# Altium project Rev1.PrjPcb
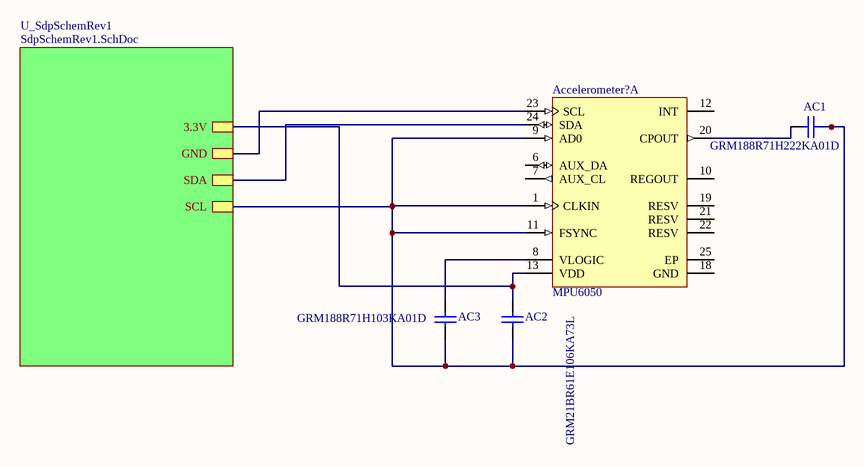
[diagram p0: Accelerometer.SchDoc]
5 sheets, 106 parts. Net scope: hierarchical (ports join the sheet entries above them; power ports are global).
Board files: Rev3.PcbDoc, Rev1.PcbDoc
Sheets:
  Accelerometer.SchDoc
    U_SdpSchemRev1 = SdpSchemRev1.SchDoc
  BLE.SchDoc
    U_SdpSchemRev1 = SdpSchemRev1.SchDoc
  SWD.SchDoc
    U_SdpSchemRev1 = SdpSchemRev1.SchDoc
  ChargingController.SchDoc
    U_SdpSchemRev1 = SdpSchemRev1.SchDoc

## Sheet Accelerometer.SchDoc
size A

### Parts
AC1  GRM188R71H222KA01D  [CAPC1608X90X35NL10T15]
AC2  GRM21BR61E106KA73L  [CAPC2013X135X45ML10T25]
AC3  GRM188R71H103KA01D  [CAPC1608X90X35ML10T15]
Accelerometer?  MPU6050  [INSE-QFN-24_V]  (part A of 2)

### Sub-sheets
U_SdpSchemRev1 = SdpSchemRev1.SchDoc: 3.3V, GND, SDA, SCL

### Nets
Net3.3V_Converter_3: AC2.2 Accelerometer?.13(VDD) ; sheet U_SdpSchemRev1/3.3V
Net3.3V_Converter_4: Accelerometer?.23(SCL) ; sheet U_SdpSchemRev1/GND
NetAC1_1: AC1.1 Accelerometer?.20(CPOUT)
NetAC1_2: AC1.2 AC2.1 AC3.1 Accelerometer?.1(CLKIN) Accelerometer?.9(AD0) Accelerometer?.11(FSYNC) ; sheet U_SdpSchemRev1/SCL
NetAC3_2: AC3.2 Accelerometer?.8(VLOGIC)
NetAccelerometer?_24: Accelerometer?.24(SDA) ; sheet U_SdpSchemRev1/SDA

Not connected (* = marked no-connect by the designer): Accelerometer? 6(AUX_DA) 7(AUX_CL) 10(REGOUT) 12(INT) 18(GND) 19(RESV) 21(RESV) 22(RESV) 25(EP)

### Library data of the parts
AC1 = CMP-1662-00006-4: Chip Capacitor, 2.2 nF, +/- 10%, 50 V, -55 to 125 degC, 0603 (1608 Metric), RoHS, Tape and Reel; Manufacturer: Murata; Voltage Rating: 50 V; Pins: 2; Mount: Surface Mount; Max Operating Temperature: 125 degC; ComponentLink1Description: Manufacturer URL; RoHSCompliant: true; PackageDescription: 2-Pin Surface Mount Device, Body 1.6 x 0.8 mm; ComponentLink2URL: http://search.murata.co.jp/Ceramy/image/img/A01X/G101/ENG/GRM188R71H222KA01-01.pdf; PackageReference: 0603; Height: 0.8 mm; Lead Pitch: 4 mm; Packaging: Tape and Reel; DatasheetVersion: 02/2016; Mounting Technology: Surface Mount; ComponentLink2Description: Datasheet; Min Operating Temperature: -55 degC; Length: 1.6 mm; REACH SVHC: No SVHC; Package Quantity: 4000; ComponentLink1URL: http://www.murata.com/
AC2 = CMP-2007-03541-1: Manufacturer: Murata; Part Number: GRM21BR61E106KA73L
AC3 = CMP-2100-03642-1: Chip Capacitor, 10 nF, +/- 10%, 50 V, -55 to 125 degC, 0603 (1608 Metric), RoHS, Tape and Reel; Manufacturer: Murata; Insulation Resistance: 10GR; Dielectric: X7R; Voltage Rating: 50V; Capacitance: 10nF; Dielectric Material: Ceramic; Package Quantity: 1; Lead Free: LeadFree; Case/Package: 0603; Termination: SMD/SMT; REACH SVHC: Unknown; Manufacturer URL: http://www.murata.com/; Datasheet URL: http://search.murata.co.jp/Ceramy/image/img/A01X/G101/ENG/GRM188R71H103KA01-01.pdf; Mount: SurfaceMount; Datasheet Version: 42401.0; Number of Pins: 2; Length: 1.6mm; Voltage: 50V; Depth: 0.8mm; Tolerance: 10%; Min Operating Temperature: -55degC; Voltage Rating (DC): 50V; Max Operating Temperature: 125degC; Package Description: 2-Pin Surface Mount Device, Body 1.6 x 0.8 mm; RoHSCompliant: True; Case Code (Imperial): 0603; Width: 0.031inch; Case Code (Metric): 1608; Height: 0.8mm; Package Reference: 0603; Packaging: TapeandReel; Thickness: 0.035inch; Material: Ceramic
Accelerometer? = CMP-1753-00002-1: 3-Axis Gyroscope, 3-Axis Accelerometer / , 2.375 to 3.46 V, -40 to 105 degC, 24-Pin QFN, RoHS, Tape and Reel; Resistance: 5.6 kohm; Tolerance: 1%; Voltage Rating: 75 V; Power Rating: 100 mW; ComponentLink1Description: Manufacturer URL; Mount: Surface Mount; Max Operating Temperature: 155degC; Package Quantity: 5000; ComponentLink2Description: Datasheet; Pins: 2; Packaging: Tape and Reel; Case Code (Imperial): 0603; PackageReference: QFN-24; ComponentLink2URL: https://datasheet.ciiva.com/1513/1788002-1513632.pdf; Radiation Hardening: No; ComponentLink1URL: http://www.invensense.com/; PackageDescription: 24-Pin Quad Flat No-lead Package, Body 4 x 4 mm, Pitch 0.5 mm; Height: 0.45 mm; Case/Package: 0603; Case Code (Metric): 1608; REACH SVHC: Yes; Min Operating Temperature: -55degC; DatasheetVersion: Rev. 3.4, 08/2013; Width: 0.8 mm; RoHSCompliant: True; Length: 1.6 mm

## Sheet SdpSchemRev1.SchDoc
size A
Used 4 times, as channels U_SdpSchemRev1, U_SdpSchemRev1, U_SdpSchemRev1, U_SdpSchemRev1. Parts and nets are listed once, with the designators drawn on the sheet.
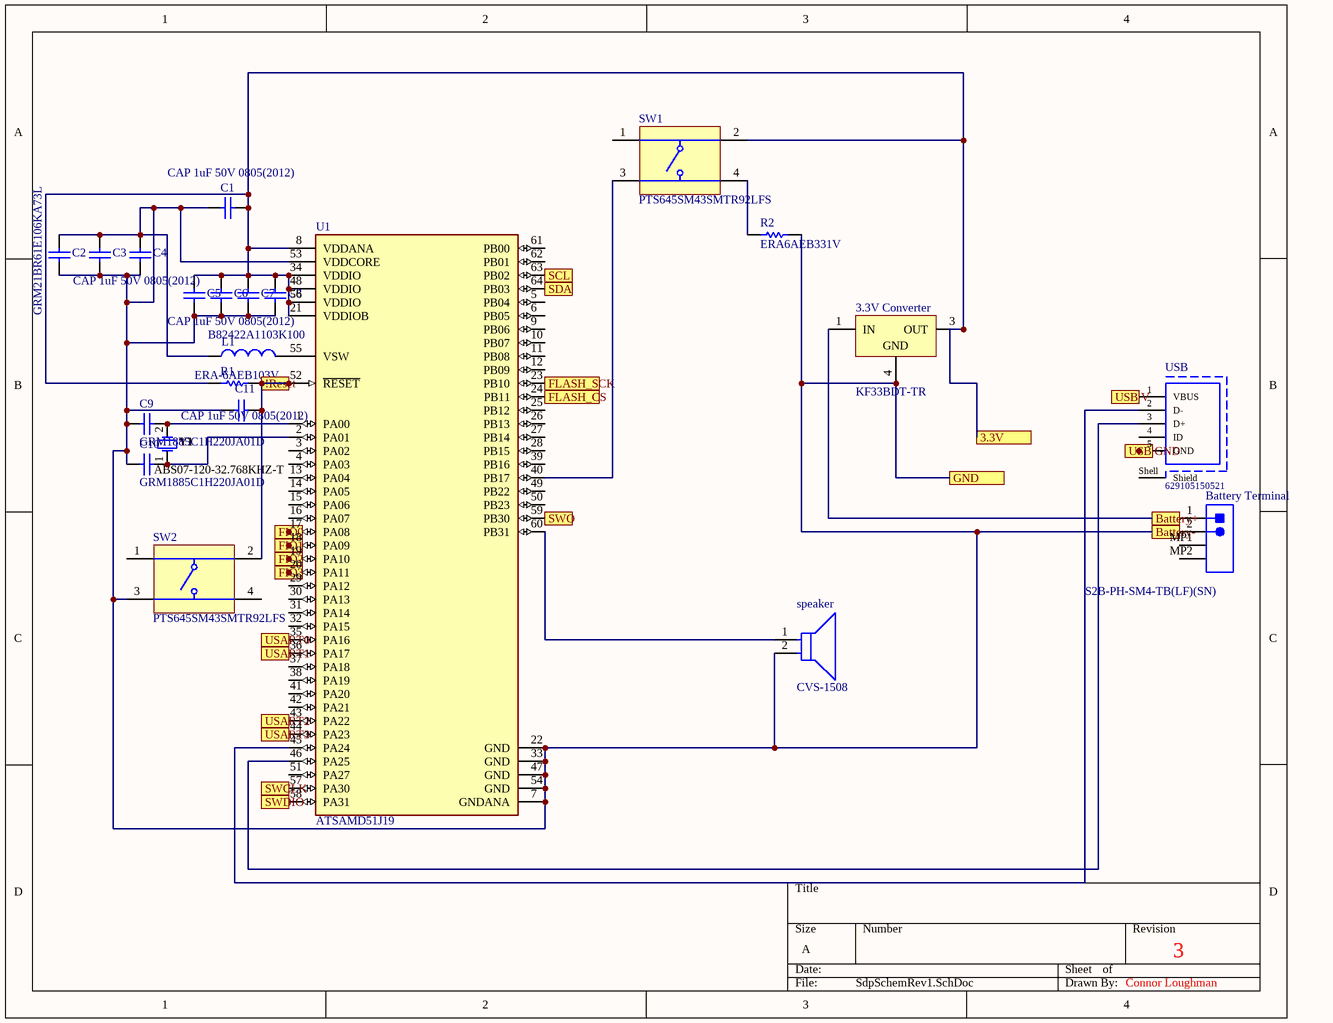
[diagram p1: SdpSchemRev1.SchDoc]

### Parts
3.3V_Converter  KF33BDT-TR  [TO-252_L]
Battery_Terminal  S2B-PH-SM4-TB(LF)(SN)  [JST- S2B-PH-SM4-TB(LF)(SN)-2_V]
C1  CAP 1uF 50V 0805(2012)  [CAPC0805(2012)145_L]
C2  GRM21BR61E106KA73L  [CAPC2013X135X45ML10T25]
C3  (no value)  [CAPC0805(2012)145_L]
C4  CAP 1uF 50V 0805(2012)  [CAPC0805(2012)145_L]
C5  (no value)  [CAPC0805(2012)145_L]
C6  (no value)  [CAPC0805(2012)145_L]
C7  (no value)  [CAPC0805(2012)145_L]
C8  CAP 1uF 50V 0805(2012)  [CAPC0805(2012)145_L]
C9  GRM1885C1H220JA01D  [CAPC1608X90X35ML10T15]
C10  GRM1885C1H220JA01D  [CAPC1608X90X35ML10T15]
C11  CAP 1uF 50V 0805(2012)  [CAPC0805(2012)145_L]
L1  B82422A1103K100  [TDK-B82422A1103K100_V]
R1  ERA-6AEB103V  [RESC2013X60X40LL20T25_A]
R2  ERA6AEB331V  [RESC2013X60X40LL20T25]
speaker  CVS-1508  [FP-CVS-1508-MFG]
SW1  PTS645SM43SMTR92LFS  [ITT-PTS645S-4_V]
SW2  PTS645SM43SMTR92LFS  [ITT-PTS645S-4_V]
U1  ATSAMD51J19  [FP-C04-085-MFG]
USB  629105150521  [629105150521]
Y1  ABS07-120-32.768KHZ-T  [ABRA-ABS07_A_V]

### Ports
3.3V, !Reset, Battery+, Battery-, FIO0, FIO1, FIO2, FIO3, FLASH_CS, FLASH_SCK, GND, SCL, SDA, SWCLK, SWDIO, SWO, USART0, USART1, USART2, USART3, USB GND, USB V

### Nets
3.3V: 3.3V_Converter.3(OUT) C1.2 C5.2 C6.2 C7.2 C8.2 R1.1 SW1.2 U1.8(VDDANA) U1.21(VDDIOB) U1.34(VDDIO) U1.48(VDDIO) U1.56(VDDIO) ; port 3.3V
!Reset: C11.2 R1.2 SW2.2 U1.52(~{RESET}) ; port !Reset
Battery+: 3.3V_Converter.1(IN) Battery_Terminal.1 ; port Battery+
Battery-: 3.3V_Converter.4(GND) Battery_Terminal.2 C1.1 C2.1 C2.2 C3.1 C3.2 C4.1 C4.2 C5.1 C6.1 C7.1 C8.1 C9.1 C10.1 C11.1 L1.1 R2.2 speaker.2(A) SW2.3 U1.7(GNDANA) U1.22(GND) U1.33(GND) U1.47(GND) U1.53(VDDCORE) U1.54(GND) ; port GND, port Battery-
FLASH_CS: U1.24(PB11) ; port FLASH_CS
FLASH_SCK: U1.23(PB10) ; port FLASH_SCK
SCL: U1.63(PB02) ; port SCL
SDA: U1.64(PB03) ; port SDA
SWCLK: U1.57(PA30) ; port SWCLK
SWDIO: U1.58(PA31) ; port SWDIO
SWO: U1.59(PB30) ; port SWO
USART0: U1.35(PA16) ; port USART0
USART1: U1.36(PA17) ; port USART1
USART2: U1.43(PA22) ; port USART2
USART3: U1.44(PA23) ; port USART3
USB V: USB.1(VBUS) ; port USB V
NetC9_2: C9.2 U1.1(PA00) Y1.2
NetC10_2: C10.2 U1.2(PA01) Y1.1
NetL1_2: L1.2 U1.55(VSW)
NetR2_1: R2.1 SW1.4
Netspeaker_1: speaker.1(C) U1.60(PB31)
NetSW1_3: SW1.3 U1.40(PB17)
NetU1_45: U1.45(PA24) USB.2(D-)
NetU1_46: U1.46(PA25) USB.3(D+)

Not connected (* = marked no-connect by the designer): Battery_Terminal MP1 MP2; SW1 1; SW2 1 4; U1 3(PA02) 4(PA03) 5(PB04) 6(PB05) 9(PB06) 10(PB07) 11(PB08) 12(PB09) 13(PA04) 14(PA05) 15(PA06) 16(PA07) 17(PA08) 18(PA09) 19(PA10) 20(PA11) 25(PB12) 26(PB13) 27(PB14) 28(PB15) 29(PA12) 30(PA13) 31(PA14) 32(PA15) 37(PA18) 38(PA19) 39(PB16) 41(PA20) 42(PA21) 49(PB22) 50(PB23) 51(PA27) 61(PB00) 62(PB01); USB 4(ID) 5(GND) Shell(Shield)

### Channels
U_SdpSchemRev1: designators 3.3V Converter=3.3V_Converter Battery Terminal=Battery_Terminal C1=C1 C2=C2 C3=C3 C4=C4 C5=C5 C6=C6 C7=C7 C8=C8 C9=C9 C10=C10 C11=C11 L1=L1 R1=R1 R2=R2 speaker=speaker_U_SdpSchemRev1#1 SW1=SW1 SW2=SW2 U1=U1 USB=USB Y1=Y1; ports 3.3V=Net3.3V_Converter_3 !Reset=NetC11_2 Battery+=Net3.3V_Converter_1 Battery-=Net3.3V_Converter_4 FIO0=open FIO1=open FIO2=open FIO3=open FLASH_CS=NetU1_24 FLASH_SCK=NetU1_23 GND=Net3.3V_Converter_4 SCL=NetAC1_2 SDA=NetAccelerometer?_24 SWCLK=NetU1_57 SWDIO=NetU1_58 SWO=NetU1_59 USART0=NetU1_35 USART1=NetU1_36 USART2=NetU1_43 USART3=NetU1_44 USB GND=open USB V=NetUSB_1
U_SdpSchemRev1: designators 3.3V Converter=3.3V_Converter_U_SdpSchemRev1#1 Battery Terminal=Battery_Terminal_U_SdpSchemRev1#1 C1=C1_U_SdpSchemRev1#1 C2=C2_U_SdpSchemRev1#1 C3=C3_U_SdpSchemRev1#1 C4=C4_U_SdpSchemRev1#1 C5=C5_U_SdpSchemRev1#1 C6=C6_U_SdpSchemRev1#1 C7=C7_U_SdpSchemRev1#1 C8=C8_U_SdpSchemRev1#1 C9=C9_U_SdpSchemRev1#1 C10=C10_U_SdpSchemRev1#1 C11=C11_U_SdpSchemRev1#1 L1=L1_U_SdpSchemRev1#1 R1=R1_U_SdpSchemRev1#1 R2=R2_U_SdpSchemRev1#1 speaker=speaker_U_SdpSchemRev1#2 SW1=SW1_U_SdpSchemRev1#1 SW2=SW2_U_SdpSchemRev1#1 U1=U1_U_SdpSchemRev1#1 USB=USB_U_SdpSchemRev1#1 Y1=Y1_U_SdpSchemRev1#1; ports 3.3V=Net3.3V_Converter_U_SdpSchemRev1#1_3 !Reset=NetC11_U_SdpSchemRev1#1_2 Battery+=Net3.3V_Converter_U_SdpSchemRev1#1_1 Battery-=Net3.3V_Converter_U_SdpSchemRev1#1_4 FIO0=NetQSPI_Flash_5 FIO1=NetQSPI_Flash_2 FIO2=NetQSPI_Flash_3 FIO3=NetQSPI_Flash_7 FLASH_CS=NetQSPI_Flash_1 FLASH_SCK=NetQSPI_Flash_6 GND=Net3.3V_Converter_U_SdpSchemRev1#1_4 SCL=NetU1_U_SdpSchemRev1#1_63 SDA=NetU1_U_SdpSchemRev1#1_64 SWCLK=NetU1_U_SdpSchemRev1#1_57 SWDIO=NetU1_U_SdpSchemRev1#1_58 SWO=NetU1_U_SdpSchemRev1#1_59 USART0=NetU_1 USART1=NetU_2 USART2=NetU_3 USART3=NetU_4 USB GND=open USB V=NetUSB_U_SdpSchemRev1#1_1
U_SdpSchemRev1: designators 3.3V Converter=3.3V_Converter_U_SdpSchemRev1#2 Battery Terminal=Battery_Terminal_U_SdpSchemRev1#2 C1=C1_U_SdpSchemRev1#2 C2=C2_U_SdpSchemRev1#2 C3=C3_U_SdpSchemRev1#2 C4=C4_U_SdpSchemRev1#2 C5=C5_U_SdpSchemRev1#2 C6=C6_U_SdpSchemRev1#2 C7=C7_U_SdpSchemRev1#2 C8=C8_U_SdpSchemRev1#2 C9=C9_U_SdpSchemRev1#2 C10=C10_U_SdpSchemRev1#2 C11=C11_U_SdpSchemRev1#2 L1=L1_U_SdpSchemRev1#2 R1=R1_U_SdpSchemRev1#2 R2=R2_U_SdpSchemRev1#2 speaker=speaker_U_SdpSchemRev1#3 SW1=SW1_U_SdpSchemRev1#2 SW2=SW2_U_SdpSchemRev1#2 U1=U1_U_SdpSchemRev1#2 USB=USB_U_SdpSchemRev1#2 Y1=Y1_U_SdpSchemRev1#2; ports 3.3V=Net3.3V_Converter_U_SdpSchemRev1#2_3 !Reset=NetC11_U_SdpSchemRev1#2_2 Battery+=Net3.3V_Converter_U_SdpSchemRev1#2_1 Battery-=Net3.3V_Converter_U_SdpSchemRev1#2_4 FIO0=open FIO1=open FIO2=open FIO3=open FLASH_CS=NetU1_U_SdpSchemRev1#2_24 FLASH_SCK=NetU1_U_SdpSchemRev1#2_23 GND=Net3.3V_Converter_U_SdpSchemRev1#2_4 SCL=NetU1_U_SdpSchemRev1#2_63 SDA=NetU1_U_SdpSchemRev1#2_64 SWCLK=NetJ_4 SWDIO=NetJ_2 SWO=NetJ_6 USART0=NetU1_U_SdpSchemRev1#2_35 USART1=NetU1_U_SdpSchemRev1#2_36 USART2=NetU1_U_SdpSchemRev1#2_43 USART3=NetU1_U_SdpSchemRev1#2_44 USB GND=open USB V=NetUSB_U_SdpSchemRev1#2_1
U_SdpSchemRev1: designators 3.3V Converter=3.3V_Converter_U_SdpSchemRev1#3 Battery Terminal=Battery_Terminal_U_SdpSchemRev1#3 C1=C1_U_SdpSchemRev1#3 C2=C2_U_SdpSchemRev1#3 C3=C3_U_SdpSchemRev1#3 C4=C4_U_SdpSchemRev1#3 C5=C5_U_SdpSchemRev1#3 C6=C6_U_SdpSchemRev1#3 C7=C7_U_SdpSchemRev1#3 C8=C8_U_SdpSchemRev1#3 C9=C9_U_SdpSchemRev1#3 C10=C10_U_SdpSchemRev1#3 C11=C11_U_SdpSchemRev1#3 L1=L1_U_SdpSchemRev1#3 R1=R1_U_SdpSchemRev1#3 R2=R2_U_SdpSchemRev1#3 speaker=speaker_U_SdpSchemRev1#4 SW1=SW1_U_SdpSchemRev1#3 SW2=SW2_U_SdpSchemRev1#3 U1=U1_U_SdpSchemRev1#3 USB=USB_U_SdpSchemRev1#3 Y1=Y1_U_SdpSchemRev1#3; ports 3.3V=Net3.3V_Converter_U_SdpSchemRev1#3_3 !Reset=NetC11_U_SdpSchemRev1#3_2 Battery+=Net3.3V_Converter_U_SdpSchemRev1#3_1 Battery-=Net3.3V_Converter_U_SdpSchemRev1#3_4 FIO0=open FIO1=open FIO2=open FIO3=open FLASH_CS=NetU1_U_SdpSchemRev1#3_24 FLASH_SCK=NetU1_U_SdpSchemRev1#3_23 GND=Net3.3V_Converter_U_SdpSchemRev1#3_4 SCL=NetU1_U_SdpSchemRev1#3_63 SDA=NetU1_U_SdpSchemRev1#3_64 SWCLK=NetU1_U_SdpSchemRev1#3_57 SWDIO=NetU1_U_SdpSchemRev1#3_58 SWO=NetU1_U_SdpSchemRev1#3_59 USART0=NetU1_U_SdpSchemRev1#3_35 USART1=NetU1_U_SdpSchemRev1#3_36 USART2=NetU1_U_SdpSchemRev1#3_43 USART3=NetU1_U_SdpSchemRev1#3_44 USB GND=NetCCR4_2 USB V=NetCCC1_1

### Notes on the sheet
- 3
- Connor Loughman

### Library data of the parts
3.3V_Converter = CMP-0244-00072-1: Very Low Drop Voltage Regulators with Inhibit, 3.3V, 3-Pin DPAK, Tape and Reel; DatasheetVersion: 21/02/2008; ComponentLink2Description: Datasheet; ComponentLink1URL: http://www.st.com; PackageVersion: 2011; ComponentLink1Description: Manufacturer URL; PackageDescription: 3-Pin Transistor Outline Package 2.28 mm Pitch, 9.7 mm Lead Span (DPAK); ComponentLink2URL: http://www.st.com/internet/com/TECHNICAL_RESOURCES/TECHNICAL_LITERATURE/DATASHEET/CD00000970.pdf; PackageReference: TO-252
Battery_Terminal = CMP-1755-00001-1: Male Header, Pitch 2 mm, 1 x 2 Position, Height 5.5 mm, -25 to 85 degC, RoHS, Tape and Reel; Current Rating: 3 A; ComponentLink1URL: http://www.jst.com/home2.html; Radiation Hardening: No; RoHSCompliant: True; Mount: Through Hole; Contact Material: Bronze; Package Quantity: 100; Width: 2.34 mm; DatasheetVersion: Dec-12; Height: 8.13 mm; Max Operating Temperature: 105degC; ComponentLink2Description: Datasheet; Lead Pitch: 0.1 inch; Contact Finish: Lead; Packaging: Bulk; Colour: Black; Contact Plating: Tin; Min Operating Temperature: -65degC; ComponentLink1Description: Manufacturer URL; PackageReference: S2B-PH-SM4-TB(LF)(SN)-2; PackageDescription: Male Header, Pitch 2 mm, 1 x 2 Position, Height 5.5 mm; ComponentLink2URL: http://www.jst-mfg.com/product/pdf/eng/ePH.pdf; Pins: 40; Length: 101.19 mm
C1 C3-C8 C11 = CMP-1036-04761-1: CAP 1uF 50V ±10% 0805 (2012 Metric) Thickness 1.45mm SMD; Tolerance: Â±10%; Case-EIA: 0805; Case-Metric: 2012; Technology: SMT; Value: 1uF; Max Thickness: 1.45 mm; Rated Voltage: 50 V
C2 = CMP-2007-03541-1: Manufacturer: Murata; Part Number: GRM21BR61E106KA73L
C9 C10 = CMP-2000-04945-1: Chip Capacitor, 22 pF, +/- 5%, 50 V, -55 to 125 degC, 0603 (1608 Metric), RoHS, Tape and Reel; Manufacturer: Murata; Capacitance: 22pF; Rated Voltage: 50V; Dielectric: C0G; Manufacturer URL: http://www.murata.com/; Datasheet Version: Jul-06; Package Reference: 603; Tolerance (%): ±5%; Case Size/Dimension: 0603; Package Description: 2-Pin Surface Mount Device, Body 1.6 x 0.8 mm; Datasheet URL: https://datasheet.ciiva.com/11786/0900766b807a1cab-11786398.pdf
L1 = CMP-2000-05912-1: Wirewound Inductor, 10 uF, +/- 10%, 180 mA, -55 to 125 degC, 2-Pin SMD, RoHS, Tape and Reel; Manufacturer: EPCOS-(TDK); Frequency - Test: 1MHz; Current Rating: 180mA; Material - Core: Ferrite; Inductance: 10µH; DC Resistance (DCR): 1.6OhmMax; Q @ Freq: 27@2.52MHz; Frequency - Self Resonant: 25MHz; Shielding: Unshielded; Series: SIMID; Size / Dimension: 0.126"Lx0.098"W(3.20mmx2.50mm); Mounting Type: SurfaceMount; Current - Saturation: -; Operating Temperature: -; Datasheet URL: https://en.tdk.eu/inf/30/db/ind_2008/b82422a_100.pdf; Ratings: AEC-Q200; Category: Inductors,Coils,Chokes; Mounting Technology: SurfaceMount; Height - Seated (Max): 0.083"(2.10mm); Family: FixedInductors; Package / Case: 1210(3225Metric); Tolerance: ±10%; Manufacturer URL: http://www.tdk.com/; Datasheet Version: 10/2012; Type: Wirewound; Packaging: CutTape(CT); Package Description: 2-Pin Surface Mount Device, Body 3.2 x 2.5 mm; Package Reference: B82422A1103K100
R1 = CMP-2000-06228-1: Metal Film Chip Resistor, High Reliability Type, 0.125 W, +/- 0.1%, -55 to 155 degC, 0805 (2012 Metric), RoHS, Tape and Reel; Voltage Rating: 100V; Power Rating: 125mW(1/8W); Brand: Panasonic; Temperature Coefficient: 25PPM/C; Resistance: 10kOhms; Product Category: ThinFilmResistors-SMD; Datasheet Version: 02/2016; Operating Temperature Range: -55Cto+155C; Length: 2mm; Mounting Technology: SurfaceMount; Manufacturer URL: http://www.panasonic.com/; Width: 1.25mm; Packaging: Reel; Product: ThinFilmResistorsSMD; Package / Case: 0805(2012metric); Termination Style: SMD/SMT; Tolerance: 0.1%; Datasheet URL: https://industrial.panasonic.com/cdbs/www-data/pdf/RDM0000/AOA0000C307.pdf; Package Description: 2-Pin Surface Mount Device, Body 2 x 1.25 mm; Factory Pack Quantity: 5000; Series: ERA-6A; Case Code - mm: 2012; RoHS: Details; Package Reference: 0805; Height: 0.5mm; Manufacturer: Panasonic; Case Code - in: 0805; Type: MetalFilmChipResistors
R2 = CMP-2001-00628-1: Manufacturer: Panasonic; Part Number: ERA6AEB331V
speaker = CMP-14846-000001-1: SPEAKER 8OHM 300MW TOP PORT 87DB; Manufacturer: CUI Inc; Resistance: 8Ω; Value: 8Ω; Frequency: 1700Hz; Package: CVS-1508; Device Class L1: Electromechanical; Manufacturer Part Number: CVS-1508; Mouser Description: Speakers & Transducers Speakers; Temperature Range High: +55°C; Octopart: https://octopart.com/cvs-1508-cui-21325683; Device Class L2: Audio Products; Temperature Range Low: -20°C; Category: Speak; Digikey Description: SPEAKER 8OHM 300MW TOP PORT 87DB; Temperature: -20°C to +55°C; Height: 8mm; ComponentLink2Description: Datasheet; ComponentLink2URL: https://www.cui.com/product/resource/cvs-1508.pdf; Device Class L3: Speakers; Lead Free: Yes; RoHS: TRUE; Automotive: No
SW1 SW2 = CMP-2000-05160-1: 6 mm Tact Switche, SPST, NO, -20 to 60 degC, 4-Pin SMT, RoHS, Tape and Reel; Manufacturer: ITT Cannon; Manufacturer URL: http://www.ittcannon.com/; Datasheet Version: Feb-14; Datasheet URL: https://datasheet.ciiva.com/29903/getdatasheetpartid-786341-29903846.pdf
U1 = CMP-06276-000034-1: IC MCU 32BIT 1MB FLASH 64TQFP; Manufacturer Part Number: ATSAMD51J20A-AU; Manufacturer: Microchip; Data Bus Width: 32bits; Number Of Adc Channels: 24; Nominal Supply Current: 7mA; Number Of I2C Channels: 6; Interface: I2C,SPI,USART,USB,LIN,Ethernet,I2S,RS-485,Other; Max Supply Voltage: 3.63V; Number Of I/Os: 51; Ram Size: 256KBytes; Memory Size: 1MBytes; Number Of Cores: 1; Max Junction Temp: +105°C; Standoff Height: 0.05mm; Automotive Grade: Grade 1; Frequency: 120MHz; Number Of Pwm Channels: 2; Core Architecture: ARM Cortex-M4F; Min Supply Voltage: 1.71V; Number Of Timers/Counters: 8; Device Class L1: Integrated Circuits (ICs); Device Class L2: Embedded Processors and Controllers; Mouser Description: MCU 32-bit ARM Cortex M4F RISC 1MB Flash 3.3V 64-Pin TQFP Tray; Height: 1.2mm; Package: C04-085; RoHS: TRUE; Automotive: Yes; Device Class L3: Microcontrollers; ComponentLink2URL: http://ww1.microchip.com/downloads/en/DeviceDoc/60001507E.pdf; Temperature: -40°C to +85°C; Ambient Temperature Range Low: -40°C; Temperature Range High: +85°C; Category: IC; Temperature Range Low: -40°C; Number Of Ethernet Channels: 1; Ambient Temperature Range High: +85°C; Octopart: https://octopart.com/atsamd51j20a-au-microchip-83497274; Digikey Description: IC MCU 32BIT 1MB FLASH 64TQFP; Number Of Usb Channels: 1; Number Of Spi Channels: 6; Memory Type: FLASH; ComponentLink2Description: Datasheet; Number Of A/D Converters: 2; Lead Free: Yes
USB = CMP-1502-03252-1: Micro USB 2.0 Type B Receptacle WR-COM, Horizontal, SMT, with Pegs, High Current at Pin 1 & Pin 5; Manufacturer: Wurth Elektronik; Contact Resistance: 30mOhm; Rated Current: 3A; Working Voltage: 30VAC; Package Reference: 629105150521; Mounting Technology: SMT; Connector Type: MicroUSB2.0TypeB; Operating Temperature: -40to85degC; Orientation: Horizontal; Manufacturer URL: http://www.we-online.de; Datasheet URL: https://katalog.we-online.de/em/datasheet/629105150521.pdf; Part Number: 629105150521; Packaging: TapeandReel; Gender: Receptacle; Publisher: WurthElektronik
Y1 = CMP-2000-07587-1: Tuning Fork Crystal, 32.768 KHz, +/- 20 ppm, -40 to 85 degC, 2-Pin SMD, RoHS, Tape and Reel; Manufacturer: Abracon; Case\/Package: SMD/SMT; Series Resistance: 60KOhm; Frequency Tolerance: 20ppm; Load Capacitance: 6pF; ESR (Equivalent Series Resistance): 55KOhm; Max Operating Temperature: 85degC; Width: 0.061inch; Radiation Hardening: No; Lead Free: LeadFree; RoHSCompliant: True; Depth: 1.5mm; Datasheet URL: http://www.abracon.com/Resonators/ABS07-120-32.768kHz-T.pdf; Frequency: 32.768KHz; Termination: SMD/SMT; Manufacturer URL: http://www.abracon.com/; Package Quantity: 3000; Packaging: TapeandReel; Number of Pins: 2; Height: 0.035inch; Package Description: 2-Pin Surface Mount Device, Body 3.2 x 1.5 mm; Package Reference: ABS07; Mount: SurfaceMount; Tolerance: 20ppm; Mounting Technology: SurfaceMount; REACH SVHC: NoSVHC; Datasheet Version: 11/2014; Length: 3.2mm; Min Operating Temperature: -40degC

## Sheet BLE.SchDoc
size A
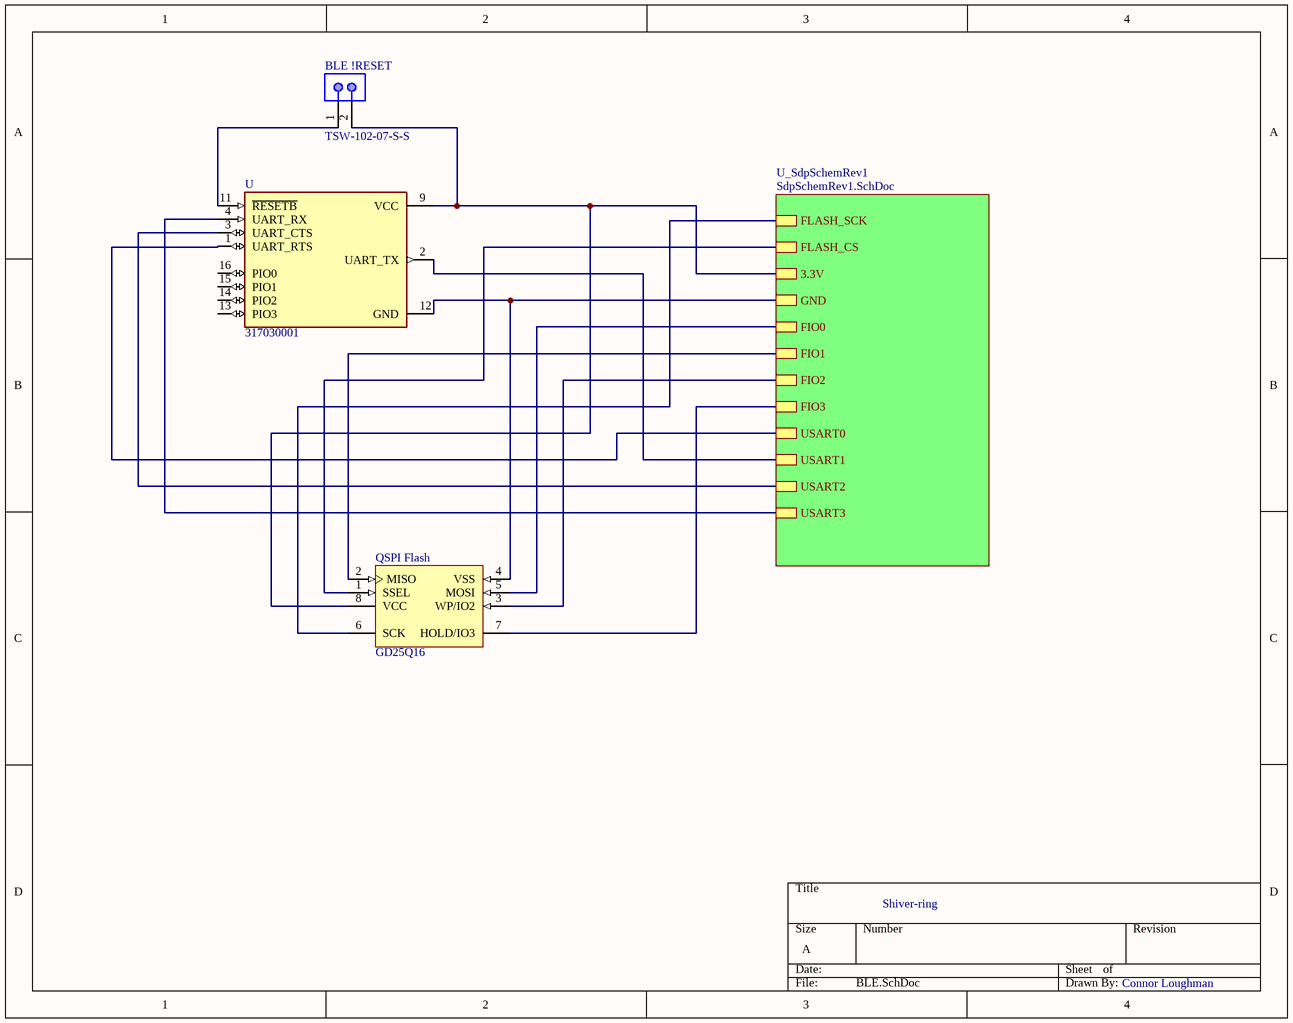
[diagram p2: BLE.SchDoc]

### Parts
BLE_!RESET  TSW-102-07-S-S  [SMTC-TSW-102-07-S-S]
QSPI_Flash  GD25Q16  [MICT-MN-8_N]
U  317030001  [XCVR_317030001]

### Sub-sheets
U_SdpSchemRev1 = SdpSchemRev1.SchDoc: FLASH_SCK, FLASH_CS, 3.3V, GND, FIO0, FIO1, FIO2, FIO3, USART0, USART1, USART2, USART3

### Nets
Net3.3V_Converter_U_SdpSchemRev1#1_3: BLE_!RESET.2 QSPI_Flash.8(VCC) U.9(VCC) ; sheet U_SdpSchemRev1/3.3V
Net3.3V_Converter_U_SdpSchemRev1#1_4: QSPI_Flash.4(VSS) U.12(GND) ; sheet U_SdpSchemRev1/GND
NetBLE_!RESET_1: BLE_!RESET.1 U.11(~{RESETB})
NetQSPI_Flash_1: QSPI_Flash.1(SSEL) ; sheet U_SdpSchemRev1/FLASH_CS
NetQSPI_Flash_2: QSPI_Flash.2(MISO) ; sheet U_SdpSchemRev1/FIO1
NetQSPI_Flash_3: QSPI_Flash.3(WP/IO2) ; sheet U_SdpSchemRev1/FIO2
NetQSPI_Flash_5: QSPI_Flash.5(MOSI) ; sheet U_SdpSchemRev1/FIO0
NetQSPI_Flash_6: QSPI_Flash.6(SCK) ; sheet U_SdpSchemRev1/FLASH_SCK
NetQSPI_Flash_7: QSPI_Flash.7(HOLD/IO3) ; sheet U_SdpSchemRev1/FIO3
NetU_1: U.1(UART_RTS) ; sheet U_SdpSchemRev1/USART0
NetU_2: U.2(UART_TX) ; sheet U_SdpSchemRev1/USART1
NetU_3: U.3(UART_CTS) ; sheet U_SdpSchemRev1/USART2
NetU_4: U.4(UART_RX) ; sheet U_SdpSchemRev1/USART3

Not connected (* = marked no-connect by the designer): U 13(PIO3) 14(PIO2) 15(PIO1) 16(PIO0)

### Notes on the sheet
- Shiver-ring
- Connor Loughman

### Library data of the parts
BLE_!RESET = CMP-1681-00004-4: Male Header, Pitch 2.54 mm, 1 x 2 Position, Height 8.38 mm, Tail Length 2.54 mm, -55 to 125 degC, RoHS, Bulk; Manufacturer: Samtec; Rows: 1; ComponentLink1URL: http://www.samtec.com/; Contact Finish: Gold; Mounting Technology: Through Hole; PackageReference: TSW-102-07-S-S; RoHSCompliant: true; Pins: 2; Contact Material: Bronze; ComponentLink2Description: Datasheet; Max Operating Temperature: 125 degC; Min Operating Temperature: -55 degC; Height: 8.38 mm; Packaging: Bulk; ComponentLink1Description: Manufacturer URL; PackageDescription: Male Header, Pitch 2.54 mm, 1 x 2 Position, Height 8.38 mm, Tail Length 2.54 mm; Colour: Black; Contact Plating: Gold; Length: 5.08 mm; ComponentLink2URL: http://suddendocs.samtec.com/catalog_english/tsw_th.pdf; DatasheetVersion: 12/2015; Mount: Through Hole; Lead Pitch: 0.1 inch; REACH SVHC: No SVHC; Package Quantity: 1
QSPI_Flash = CMP-0357-00068-1: 1 Mb (x1) Serial NOR Flash Memory with Page Erase, 75 MHz, 2.7 to 3.6 V, 8-pin SO8 Narrow (MN), Tube; Part Family: M45PE; Manufacturer: Micron; PartNumber: M45PE10-VMN6P; Speed: 75 MHz; Voltage: 2.7V-3.6V; Density: 1Mb; PackageReference: MICT-MN-8; PackageDescription: 8-Pin SO Narrow, 3.9 X 4.9 mm, Pitch 1.27 mm; Part Status: Production; Mounting Technology: Surface Mount; ComponentLink2Description: Datasheet; ComponentLink1URL: http://www.micron.com/; DatasheetVersion: Rev. 8; ComponentLink1Description: Manufacturer URL; Type: Page Erase; Applications: Embedded; Width: x1; ComponentLink3URL: http://www.micron.com/~/media/Documents/Products/Data%20Sheet/NOR%20Flash/Serial%20NOR/M25P/M25P05A.pdf; RoHS: Yes; ComponentLink2URL: http://www.micron.com/~/media/Documents/Products/Data%20Sheet/NOR%20Flash/Serial%20NOR/M25PE_M45PE/M45PE10.pdf; Package: SO8 Narrow; ComponentLink3Description: Package Specification; PackageVersion: Rev 11
U = 317030001: Bluetooth Bluetooth v4.0 Transceiver Module 2.4GHz Integrated, Trace Surface Mount; MF: Seeed Technology; Value: *; SnapEDA_Link: https://www.snapeda.com/parts/317030001/Seeed%20Technology%20Co.%2C%20Ltd/view-part/449174/?ref=snap; Digi-Key_Purchase_URL: https://www.digikey.kr/product-detail/en/seeed-technology-co-ltd/317030001/1597-1359-ND/5487659?utm_source=snapeda&utm_medium=aggregator&utm_campaign=symbol; MP: 317030001; Digi-Key_Part_Number: 1597-1359-ND; Package: Module Seeed Technology

## Sheet SWD.SchDoc
size A
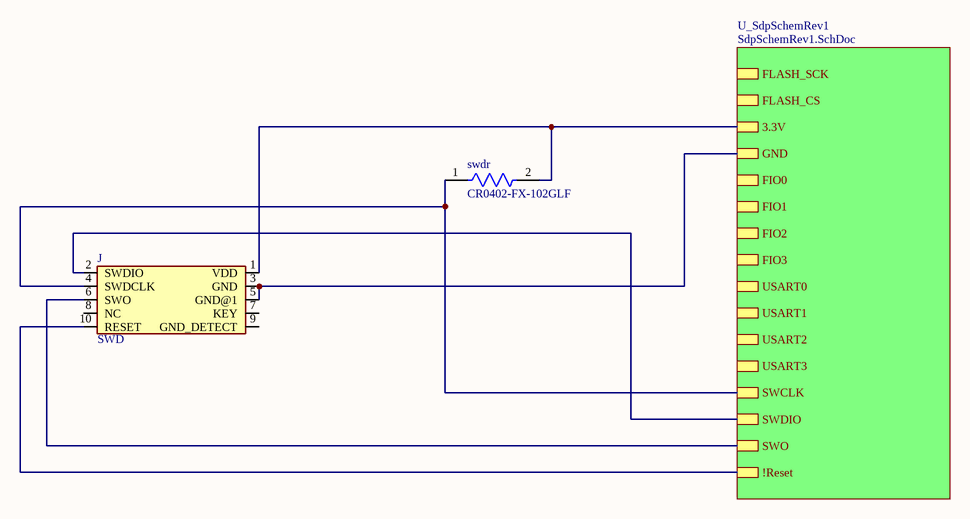
[diagram p3: SWD.SchDoc]

### Parts
J  SWD  [2X10_BOXHEADER]
swdr  CR0402-FX-102GLF  [FP-CR0402-IPC_C]

### Sub-sheets
U_SdpSchemRev1 = SdpSchemRev1.SchDoc: FLASH_SCK, FLASH_CS, 3.3V, GND, FIO0, FIO1, FIO2, FIO3, USART0, USART1, USART2, USART3, SWCLK, SWDIO, SWO, !Reset

### Nets
Net3.3V_Converter_U_SdpSchemRev1#2_3: J.1(VDD) swdr.2 ; sheet U_SdpSchemRev1/3.3V
Net3.3V_Converter_U_SdpSchemRev1#2_4: J.3(GND) J.5(GND@1) ; sheet U_SdpSchemRev1/GND
NetC11_U_SdpSchemRev1#2_2: J.10(RESET) ; sheet U_SdpSchemRev1/!Reset
NetJ_2: J.2(SWDIO) ; sheet U_SdpSchemRev1/SWDIO
NetJ_4: J.4(SWDCLK) swdr.1 ; sheet U_SdpSchemRev1/SWCLK
NetJ_6: J.6(SWO) ; sheet U_SdpSchemRev1/SWO

Not connected (* = marked no-connect by the designer): J 7(KEY) 8(NC) 9(GND_DETECT)

### Library data of the parts
J = SWD: SWD WRITEON W/DISP .75X1.4 LAB; MF: 3M; Price: None; Value: *; Package: None; SnapEDA_Link: https://www.snapeda.com/parts/SWD/3M%20%28TC%29/view-part/172681/?ref=snap; MP: SWD; Availability: Unavailable
swdr = CMP-2002-04703-2: Thick Film Chip Resistors 0402 1kΩ 0.0625W 1% 100ppm/°C; Voltage Rating: 50V; Max Power Dissipation: 63mW; Resistance: 1kR; Power Rating: 62.5mW; Package Quantity: 10000; Radiation Hardening: No; Temperature Coefficient: 100ppm/°C; Number of Terminations: 2; Packaging: Tape and Reel; Thickness: 356um; Case Code (Metric): 1005; Case/Package: 0402; Case Code (Imperial): 0402; Max Operating Temperature: 155°C; Composition: Thick Film; Min Operating Temperature: -55°C; Mount: Surface Mount; Tolerance: 1%; Termination: SMD/SMT; Width: 0.02inch; Contact Plating: Tin; Height: 0.016inch; Length: 0.039inch

## Sheet ChargingController.SchDoc
size A
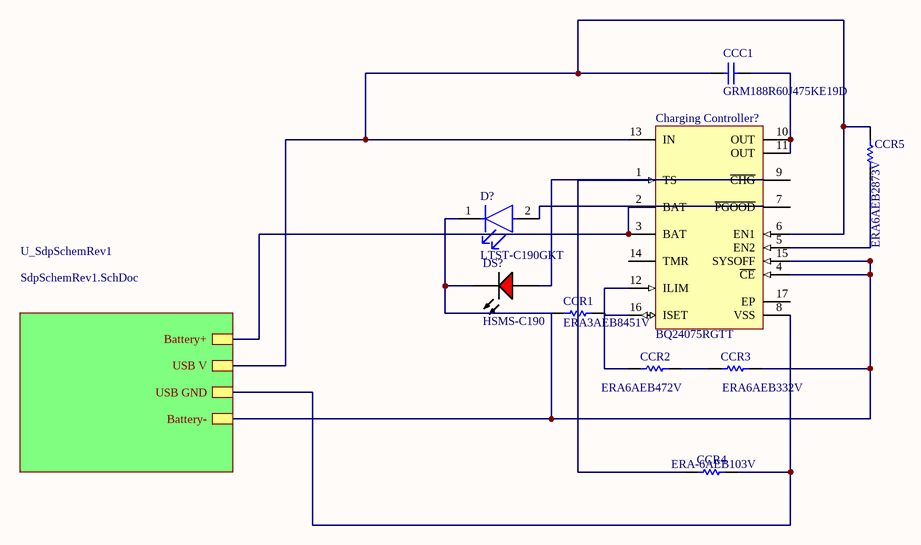
[diagram p4: ChargingController.SchDoc]

### Parts
CCC1  GRM188R60J475KE19D  [CAPC1608X90X35ML10T15]
CCR1  ERA3AEB8451V  [RESC1608X55X30ML20T20]
CCR2  ERA6AEB472V  [RESC2013X60X40ML20T25]
CCR3  ERA6AEB332V  [RESC2013X60X40NL20T25]
CCR4  ERA-6AEB103V  [RESC2013X60X40LL20T25_A]
CCR5  ERA6AEB2873V  [RESC2013X60X40LL20T25]
Charging_Controller?  BQ24075RGTT  [RGT0016C_V]
D?  LTST-C190GKT  [FP-LTST-C190GKT-MFG]
DS?  HSMS-C190  [AVAG-HSMX-C190_V]

### Sub-sheets
U_SdpSchemRev1 = SdpSchemRev1.SchDoc: Battery+, USB V, USB GND, Battery-

### Nets
Net3.3V_Converter_U_SdpSchemRev1#3_1: Charging_Controller?.2(BAT) Charging_Controller?.3(BAT) ; sheet U_SdpSchemRev1/Battery+
Net3.3V_Converter_U_SdpSchemRev1#3_4: CCR1.1 CCR3.2 Charging_Controller?.4(~{CE}) Charging_Controller?.15(SYSOFF) D?.1(C) DS?.2(K) ; sheet U_SdpSchemRev1/Battery-
NetCCC1_1: CCC1.1 CCR5.2 Charging_Controller?.6(EN1) Charging_Controller?.13(IN) ; sheet U_SdpSchemRev1/USB V
NetCCC1_2: CCC1.2 Charging_Controller?.10(OUT) Charging_Controller?.11(OUT)
NetCCR1_2: CCR1.2 CCR2.1 Charging_Controller?.12(ILIM) Charging_Controller?.16(ISET)
NetCCR2_2: CCR2.2 CCR3.1
NetCCR4_1: CCR4.1 Charging_Controller?.1(TS) DS?.1(A)
NetCCR4_2: CCR4.2 Charging_Controller?.8(VSS) ; sheet U_SdpSchemRev1/USB GND
NetCCR5_1: CCR5.1 Charging_Controller?.5(EN2)

Not connected (* = marked no-connect by the designer): Charging_Controller? 7(~{PGOOD}) 9(~{CHG}) 14(TMR) 17(EP); D? 2(A)

### Library data of the parts
CCC1 = CMP-2006-02799-2: Chip Capacitor, 4.7 uF, +/- 10%, 6.3 V, -55 to 85 degC, 0603 (1608 Metric), RoHS, Tape and Reel; Voltage Rating (DC): 3 V; Voltage Rating: 6.3 V; Type (Capacitors): X5R; Capacitance: 4.7 uF; Case/Package: 0603; Case Code (Imperial): 0603; Packaging: Tape and Reel; Mount: Surface Mount; Height: 0.8 mm; REACH SVHC: No SVHC; ComponentLink1URL: http://www.murata.com/; ComponentLink2URL: http://psearch.en.murata.com/capacitor/product/GRM188R60J475KE19%23.pdf; Min Operating Temperature: -55 degC; Max Operating Temperature: 85 degC; Length: 1.6 mm; Case Code (Metric): 1608; Radiation Hardening: No; PackageDescription: 2-Pin Surface Mount Device, Body 1.6 x 0.8 mm; RoHSCompliant: true; PartNumber: GRM188R60J475KE19D; Tolerance: 10%; Width: 0.8 mm; ComponentLink1Description: Manufacturer URL; Mounting Technology: Surface Mount; ComponentLink2Description: Datasheet; Package Quantity: 4000; DatasheetVersion: 08/2016
CCR1 = CMP-2000-00133-1: Manufacturer: Panasonic; Part Number: ERA3AEB8451V
CCR2 = CMP-2001-00644-1: Manufacturer: Panasonic; Part Number: ERA6AEB472V
CCR3 = CMP-2001-00629-1: Manufacturer: Panasonic; Part Number: ERA6AEB332V
CCR4 = CMP-2000-06228-1: as R1 on sheet SdpSchemRev1; Product Category: ThinFilmResistors-SMD; Datasheet Version: 02/2016; Operating Temperature Range: -55Cto+155C; Length: 2mm; Mounting Technology: SurfaceMount; Manufacturer URL: http://www.panasonic.com/; Width: 1.25mm; Packaging: Reel; Product: ThinFilmResistorsSMD; Package / Case: 0805(2012metric); Termination Style: SMD/SMT; Tolerance: 0.1%; Datasheet URL: https://industrial.panasonic.com/cdbs/www-data/pdf/RDM0000/AOA0000C307.pdf; Package Description: 2-Pin Surface Mount Device, Body 2 x 1.25 mm; Factory Pack Quantity: 5000; Series: ERA-6A; Case Code - mm: 2012; RoHS: Details; Package Reference: 0805; Height: 0.5mm; Manufacturer: Panasonic; Case Code - in: 0805; Type: MetalFilmChipResistors
CCR5 = CMP-2001-00791-1: Manufacturer: Panasonic; Part Number: ERA6AEB2873V
Charging_Controller? = CMP-0321-00236-2: USB-Friendly Li-Ion Battery Charger and Power-Path Management IC, Vout 5.5 V, 4.3 V, -40 to 85 degC, 16-pin QFN (RGT), Green (RoHS & no Sb/Br); Manufacturer: Texas Instruments; Vin(Min)(V): 4.3; SubFamily: Battery Charge Management; NiMH: N; PackageDescription: 16-Pin Plastic Quad Flat No-Lead, 3 x 3 mm Body, 0.5 mm Pitch, 1.7 x 1.7 mm Exposed Pad; PartNumber: BQ24075RGTT; PackageVersion: revH, Oct-2011; Eco-Plan: Green (RoHS & no Sb/Br); Code_JEDEC: MO-220; ComponentLink1Description: Datasheet; PackageReference: RGT0016C; NiCd: N; Li-Polymer: N; DatasheetVersion: SLUS810G; ComponentLink1URL: http://www.ti.com/general/docs/lit/getliterature.tsp?genericPartNumber=BQ24075&fileType=pdf; Over Voltage Protection: N; Mounting Technology: Surface Mount; Lead Acid: N; Li-Ion: N
D? = CMP-22017-000018-1: LED GREEN CLEAR CHIP SMD; Dominant Wavelength: 569nm; Reverse Voltage: 5V; Lens Color: Colorless; Viewing Angle: 130°; Voltage: 2V; Forward Current: 30mA; Power Dissipation: 100mW; Luminous Intensity: 6mcd; Number of LEDs: 1; Forward Voltage: 2.1V; Wavelength: 565nm; Test Current: 10mA; Min Operating Temperature: -55°C; Lens Style: Clear; Mount: Surface Mount; Width: 0.8mm; Packaging: Tape and Reel; Lens Transparency: Clear; Case Code (Metric): 1608; Depth: 0.8mm; Case Code (Imperial): 0603; Case/Package: 0603; Number of Pins: 2; Max Operating Temperature: 85°C; Lead Free: Lead Free; Number of Elements: 1; Length: 1.6mm; Height: 0.8mm; Package Quantity: 1; Power Rating: 100mW; Radiation Hardening: No; Illumination Color: Green; Color: Green
DS? = CMP-2000-06427-1: LED Uni-Color Red, 52 mW, 20 mA, -40 to 85 degC, 2-Pin SMD, RoHS, Tape and Reel; Manufacturer: Avago; Reverse Voltage: 5V; Viewing Angle: 170deg; High Brightness: No; Lens Type: ColorlessDiffused; DELETED: Compliant; Product Height (mm): 0.8mm; Dominant Wave Length: 626nm; Number of  Elements: 1; Chip Material: GaP; Lum Intensity: 10mcd; Product Length (mm): 1.6mm; Forward Voltage: 2.6V; Power Dissipation: 52W; Shape Type: Rectangular; Forward Current: 25mA; Peak Wavelength: 630nm; Test Current (It): 20mA; Main Category: ChipLED; Lens Dimensions: 1x0.8x0.5mm; Pin Count: 2; Package Reference: HSMX-C190; Mounting Technology: SurfaceMount; Mounting: SurfaceMount; Datasheet URL: http://docs.avagotech.com/docs/AV02-0551EN; Package Type: ChipLed; Operating Temperature Classification: Industrial; Datasheet Version: 03/2012; Operating Temp Range: -40Cto85C; Emitting Color: Red; Rad Hardened: No; Manufacturer URL: http://www.avagotech.com/; Luminous Intensity: 10mcd; Package Description: 2-Pin Surface Mount Device, Body 1.6 x 0.8 mm, Height 0.9 mm; Type: Uni-Color; Packaging: TapeandReel; Product Depth (mm): 0.8mm

## Nets that join several sheets
Net3.3V_Converter_3: Accelerometer (AC2.2 Accelerometer?.13), U_SdpSchemRev1 (13 pins)
Net3.3V_Converter_4: Accelerometer (Accelerometer?.23), U_SdpSchemRev1 (26 pins)
Net3.3V_Converter_U_SdpSchemRev1#1_3: BLE (BLE_!RESET.2 QSPI_Flash.8 U.9), U_SdpSchemRev1 (13 pins)
Net3.3V_Converter_U_SdpSchemRev1#1_4: BLE (QSPI_Flash.4 U.12), U_SdpSchemRev1 (26 pins)
Net3.3V_Converter_U_SdpSchemRev1#2_3: SWD (J.1 swdr.2), U_SdpSchemRev1 (13 pins)
Net3.3V_Converter_U_SdpSchemRev1#2_4: SWD (J.3 J.5), U_SdpSchemRev1 (26 pins)
Net3.3V_Converter_U_SdpSchemRev1#3_1: ChargingController (Charging_Controller?.2 Charging_Controller?.3), U_SdpSchemRev1 (3.3V_Converter_U_SdpSchemRev1#3.1 Battery_Terminal_U_SdpSchemRev1#3.1)
Net3.3V_Converter_U_SdpSchemRev1#3_4: ChargingController (6 pins), U_SdpSchemRev1 (26 pins)
NetAC1_2: Accelerometer (6 pins), U_SdpSchemRev1 (U1.63)
NetAccelerometer?_24: Accelerometer (Accelerometer?.24), U_SdpSchemRev1 (U1.64)
NetC11_U_SdpSchemRev1#2_2: SWD (J.10), U_SdpSchemRev1 (C11_U_SdpSchemRev1#2.2 R1_U_SdpSchemRev1#2.2 SW2_U_SdpSchemRev1#2.2 U1_U_SdpSchemRev1#2.52)
NetCCC1_1: ChargingController (CCC1.1 CCR5.2 Charging_Controller?.6 Charging_Controller?.13), U_SdpSchemRev1 (USB_U_SdpSchemRev1#3.1)
NetJ_2: SWD (J.2), U_SdpSchemRev1 (U1_U_SdpSchemRev1#2.58)
NetJ_4: SWD (J.4 swdr.1), U_SdpSchemRev1 (U1_U_SdpSchemRev1#2.57)
NetJ_6: SWD (J.6), U_SdpSchemRev1 (U1_U_SdpSchemRev1#2.59)
NetQSPI_Flash_1: BLE (QSPI_Flash.1), U_SdpSchemRev1 (U1_U_SdpSchemRev1#1.24)
NetQSPI_Flash_6: BLE (QSPI_Flash.6), U_SdpSchemRev1 (U1_U_SdpSchemRev1#1.23)
NetU_1: BLE (U.1), U_SdpSchemRev1 (U1_U_SdpSchemRev1#1.35)
NetU_2: BLE (U.2), U_SdpSchemRev1 (U1_U_SdpSchemRev1#1.36)
NetU_3: BLE (U.3), U_SdpSchemRev1 (U1_U_SdpSchemRev1#1.43)
NetU_4: BLE (U.4), U_SdpSchemRev1 (U1_U_SdpSchemRev1#1.44)